# Altium schematic sheet [07] - DEBUGGING & PROGRAMMING.SchDoc
size A4
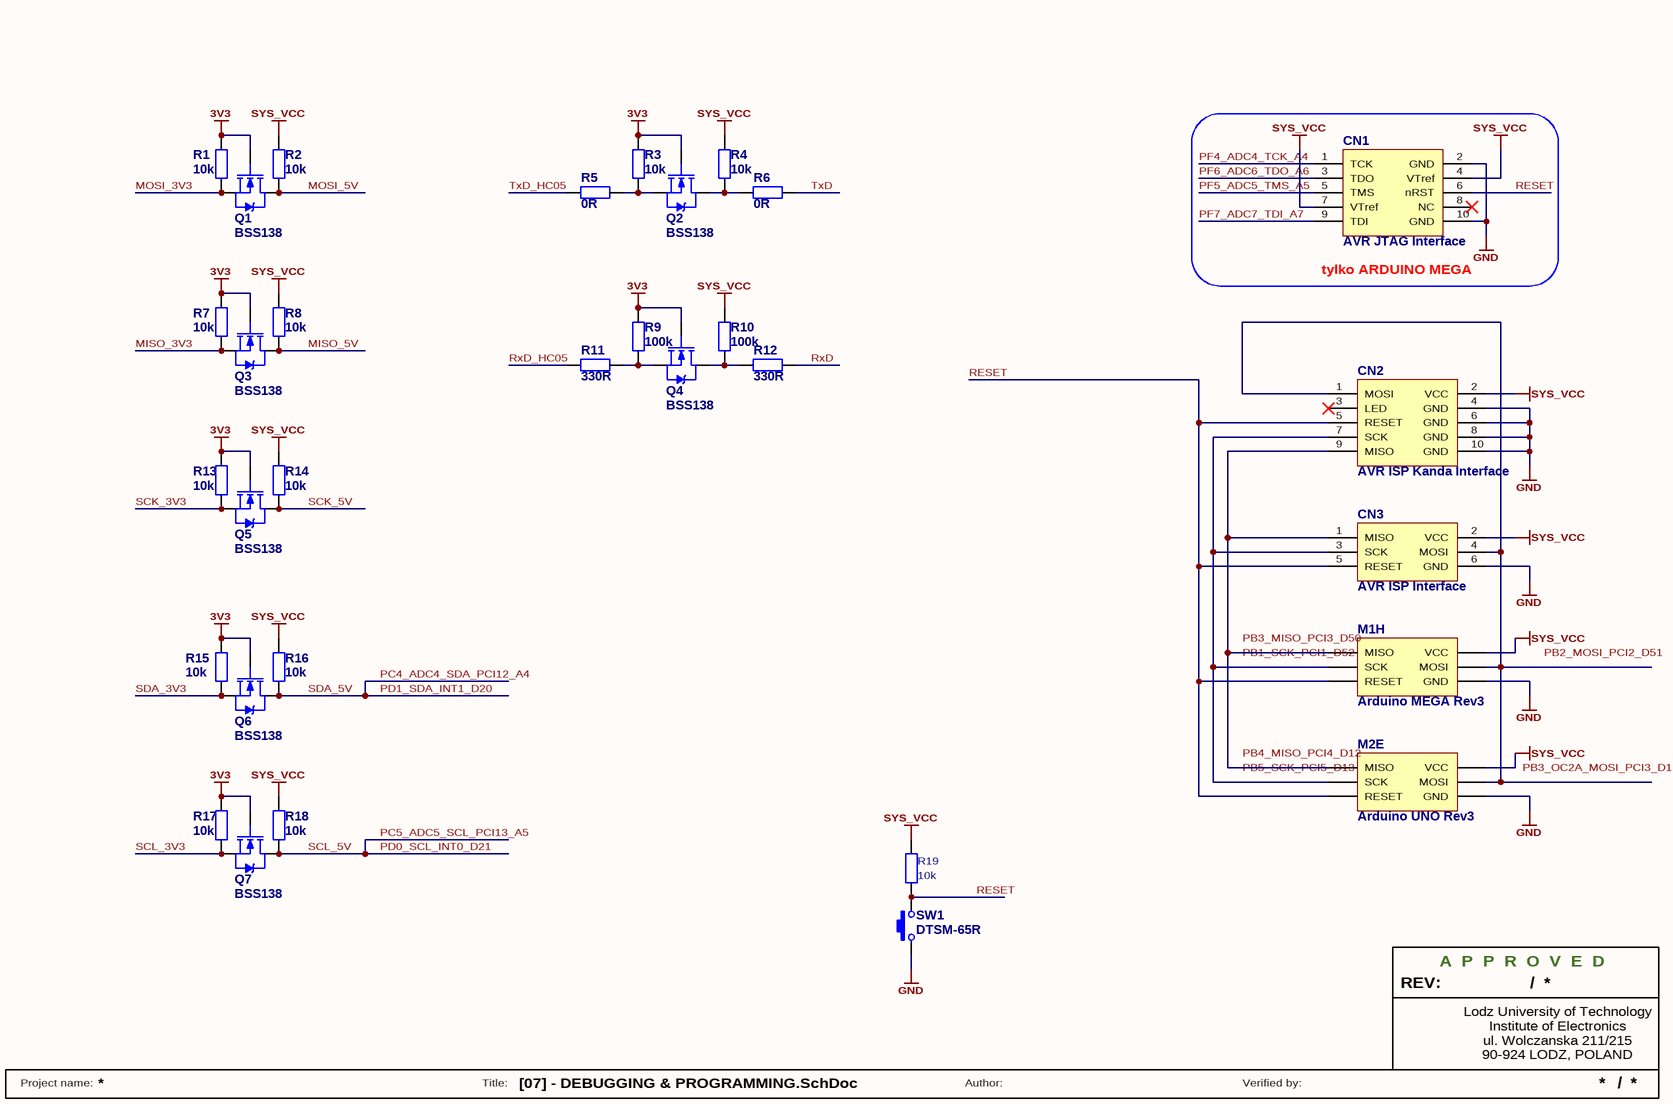
[diagram p0: [07] - DEBUGGING & PROGRAMMING.SchDoc]

## Parts
CN1  AVR JTAG Interface  [IDC10]
CN2  AVR ISP Kanda Interface  [IDC10]
CN3  AVR ISP Interface  [IDC6]
M1  Arduino MEGA Rev3  [Arduino_MEGA_UPSIDE_DOWN]  (part H of 8)
M2  Arduino UNO Rev3  [Arduino_UNO_UPSIDE_DOWN]  (part E of 5)
Q1  BSS138  [SOT-23]
Q2  BSS138  [SOT-23]
Q3  BSS138  [SOT-23]
Q4  BSS138  [SOT-23]
Q5  BSS138  [SOT-23]
Q6  BSS138  [SOT-23]
Q7  BSS138  [SOT-23]
R1  10k  [R0805]
R2  10k  [R0805]
R3  10k  [R0805]
R4  10k  [R0805]
R5  0R  [R0805]
R6  0R  [R0805]
R7  10k  [R0805]
R8  10k  [R0805]
R9  100k  [R0805]
R10  100k  [R0805]
R11  330R  [R0805]
R12  330R  [R0805]
R13  10k  [R0805]
R14  10k  [R0805]
R15  10k  [R0805]
R16  10k  [R0805]
R17  10k  [R0805]
R18  10k  [R0805]
R19  10k  [R0805]
SW1  DTSM-65R  [DTSM-65R]

## Blocks framed on the sheet
tylko ARDUINO MEGA: CN1

## Nets
3V3: Q1.1(G) Q2.1(G) Q3.1(G) Q4.1(G) Q5.1(G) Q6.1(G) Q7.1(G) R1.2 R3.1 R7.2 R9.1 R13.2 R15.2 R17.2
GND: CN1.2(GND) CN1.10(GND) CN2.4(GND) CN2.6(GND) CN2.8(GND) CN2.10(GND) CN3.6(GND) M1.PROG6(GND) M2.PROG6(GND) SW1.1
SYS_VCC: CN1.4(VTref) CN1.7(VTref) CN2.2(VCC) CN3.2(VCC) M1.PROG2(VCC) M2.PROG2(VCC) R2.2 R4.1 R8.2 R10.1 R14.2 R16.2 R18.2 R19.2
MISO_3V3: Q3.2(S) R7.1
MISO_5V: Q3.3(D) R8.1
MOSI_3V3: Q1.2(S) R1.1
MOSI_5V: Q1.3(D) R2.1
PC4_ADC4_SDA_PCI12_A4: Q6.3(D) R16.1  [also labelled PD1_SDA_INT1_D20, SDA_5V]
PC5_ADC5_SCL_PCI13_A5: Q7.3(D) R18.1  [also labelled PD0_SCL_INT0_D21, SCL_5V]
PF4_ADC4_TCK_A4: CN1.1(TCK)
PF5_ADC5_TMS_A5: CN1.5(TMS)
PF6_ADC6_TDO_A6: CN1.3(TDO)
PF7_ADC7_TDI_A7: CN1.9(TDI)
RESET: CN1.6(nRST) CN2.5(RESET) CN3.5(RESET) M1.PROG5(RESET) M2.PROG5(RESET) R19.1 SW1.2
RxD: R12.2
RxD_HC05: R11.1
SCK_3V3: Q5.2(S) R13.1
SCK_5V: Q5.3(D) R14.1
SCL_3V3: Q7.2(S) R17.1
SDA_3V3: Q6.2(S) R15.1
TxD: R6.2
TxD_HC05: R5.1
NetCN2_1: CN2.1(MOSI) CN3.4(MOSI) M1.PROG4(MOSI) M2.PROG4(MOSI)
NetCN2_7: CN2.7(SCK) CN3.3(SCK) M1.PROG3(SCK) M2.PROG3(SCK)
NetCN2_9: CN2.9(MISO) CN3.1(MISO) M1.PROG1(MISO) M2.PROG1(MISO)
NetQ2_2: Q2.2(S) R3.2 R5.2
NetQ2_3: Q2.3(D) R4.2 R6.1
NetQ4_2: Q4.2(S) R9.2 R11.2
NetQ4_3: Q4.3(D) R10.2 R12.1

Not connected (* = marked no-connect by the designer): CN1 8(NC)*; CN2 3(LED)*

## Notes on the sheet
- Labels drawn without touching a wire or pin: PB1_SCK_PCI1_D52, PB2_MOSI_PCI2_D51, PB3_MISO_PCI3_D50, PB3_OC2A_MOSI_PCI3_D11, PB4_MISO_PCI4_D12, PB5_SCK_PCI5_D13
- REV:
- A  P  P  R  O  V  E  D
- /
- Lodz University of Technology
- ul. Wolczanska 211/215
- 90-924 LODZ, POLAND
- Institute of Electronics
- Project name:
- Title:
- Author:
- Verified by:

## Library data of the parts
CN1 = AVR JTAG Interface: JTAG Header for AVR MCU's
CN2 = AVR ISP Kanda Interface: Kanda ISP Programming Header for AVR MCU's
CN3 = AVR ISP Interface: ISP Programming Header for AVR MCU's
M1 = Arduino MEGA Rev3: Arduino MEGA Rev3 Board
M2 = Arduino UNO Rev3: Arduino UNO Rev3 Board
Q1-Q7 = BSS138: N-Channel Enhancement Mode Vertical DMOS FET; Published: 17-Dec-2003; DatasheetVersion: Mar-96; PackageVersion: 1996; PackageReference: SOT23; Publisher: Altium Limited; PackageDescription: SOT-23; 3 Leads; Body 3.1 x 2.5 mm, inc. leads (LxW max), Alternate Lead Configuration; ComponentLink1Description: Manufacturer Link; ComponentLink1URL: http://www.zetex.com/; ComponentLink2Description: Datasheet; ComponentLink2URL: www.zetex.com/3.0/pdf/BSS138.pdf
R1-R19 = Res: Resistor; Published: 19-Feb-2006; ComponentLink1Description: datasheet; ComponentLink2Description: supplier
  R1-R4 R7 R8 R13-R19: Value: 10k
  R5 R6: Value: 0R
  R9 R10: Value: 100k
  R11 R12: Value: 330R
SW1 = DTSM-65R: DIPTRONICS Red 6x6mm SMD Tactile SPST-NO Switch; Supplier 1: TME; Supplier Part Number 1: DTSM-65R-V-B